# Altium schematic sheet 0128_EC - MISCELLANEOUS.SchDoc
size 848 x 558 mm
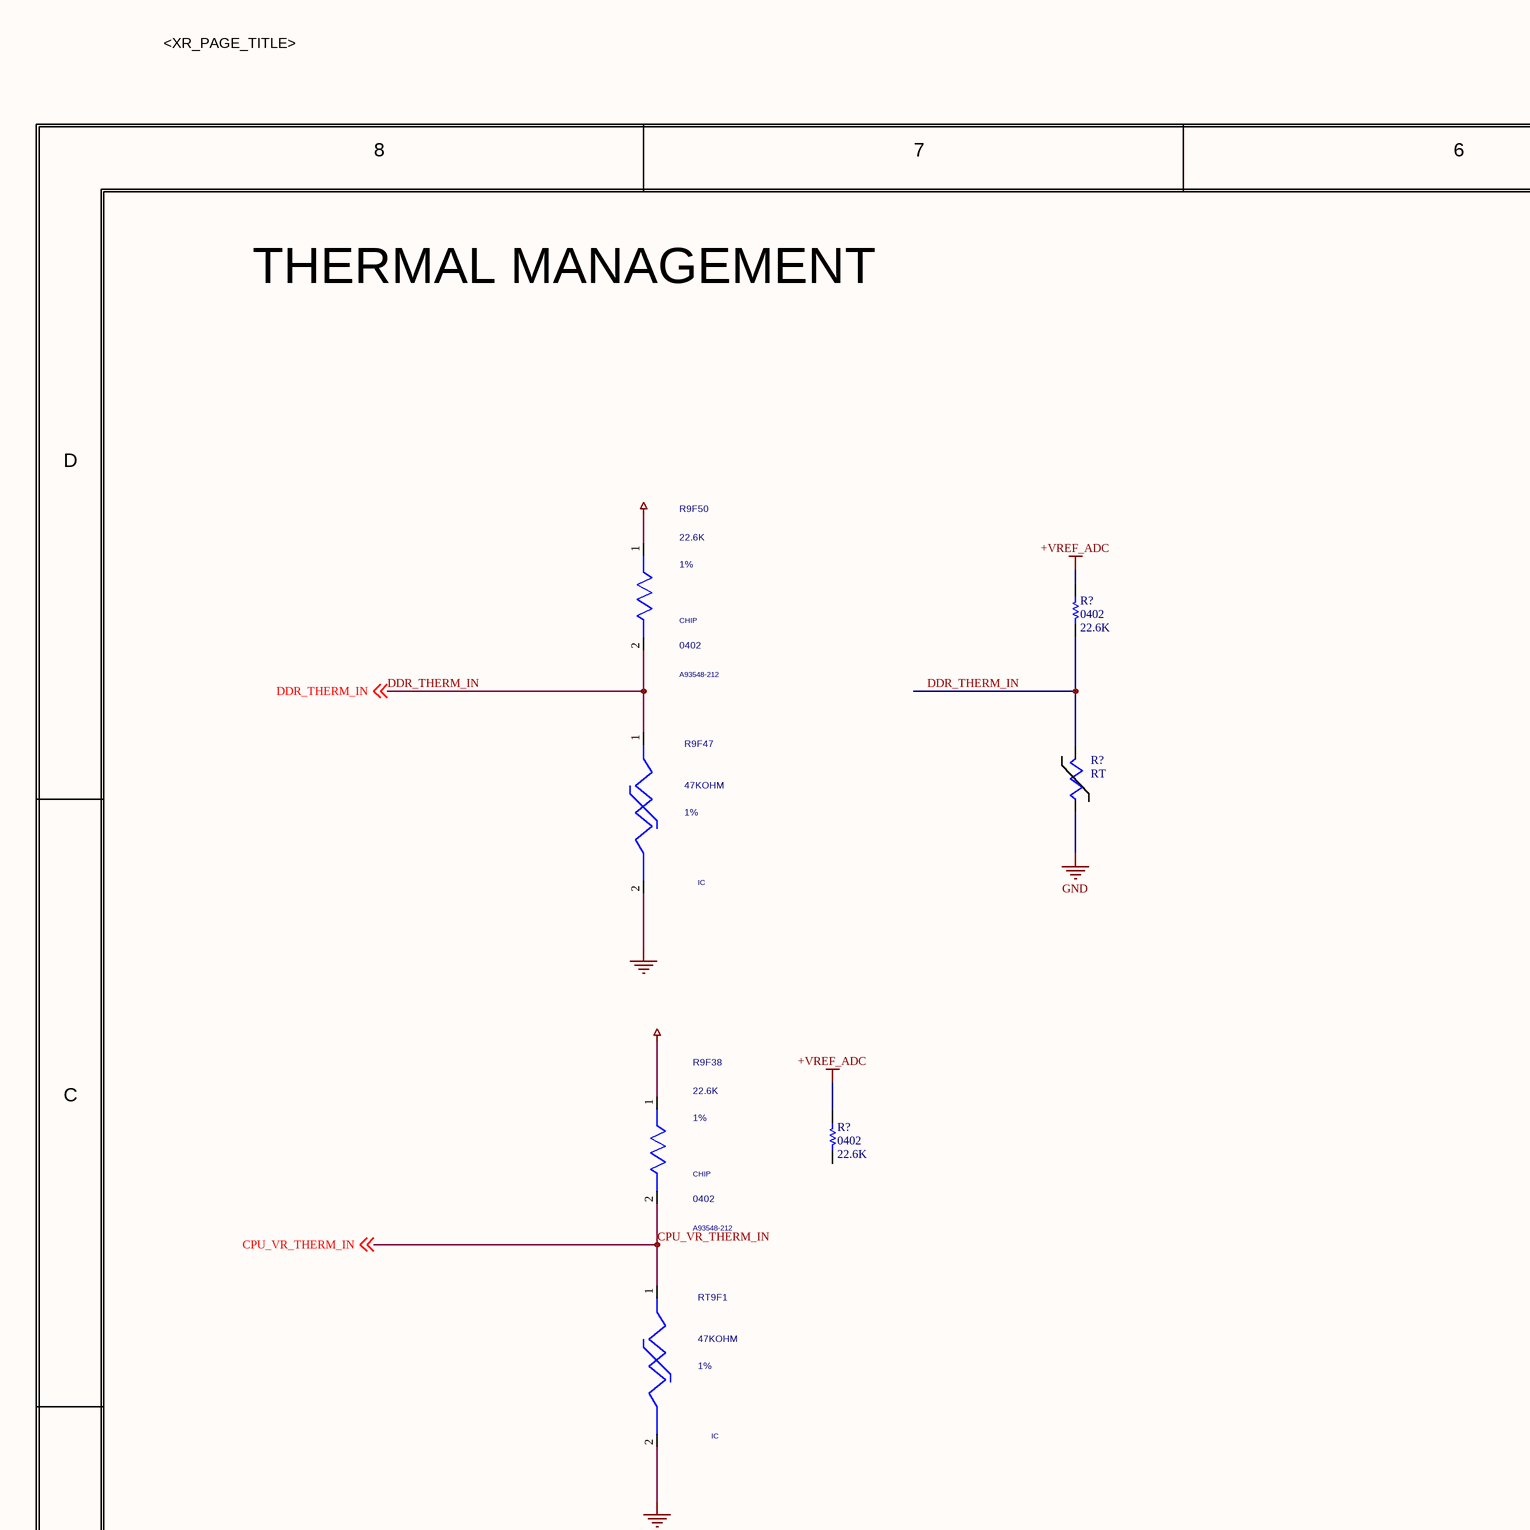
[diagram p0: 0128_EC - MISCELLANEOUS.SchDoc, top left]
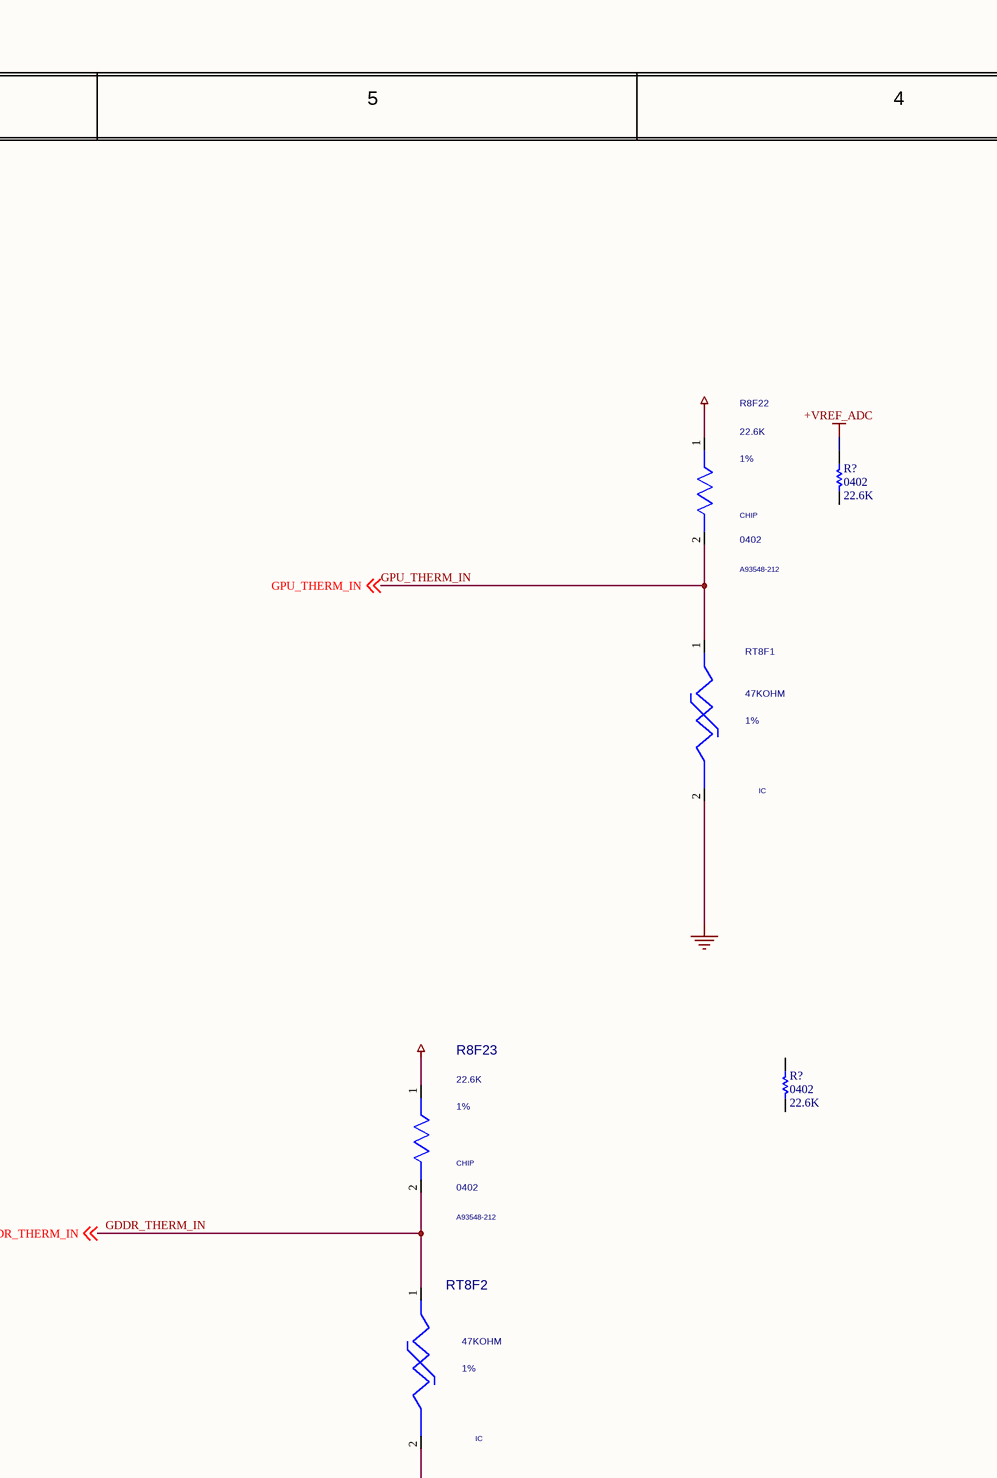
[diagram p1: 0128_EC - MISCELLANEOUS.SchDoc, top middle]
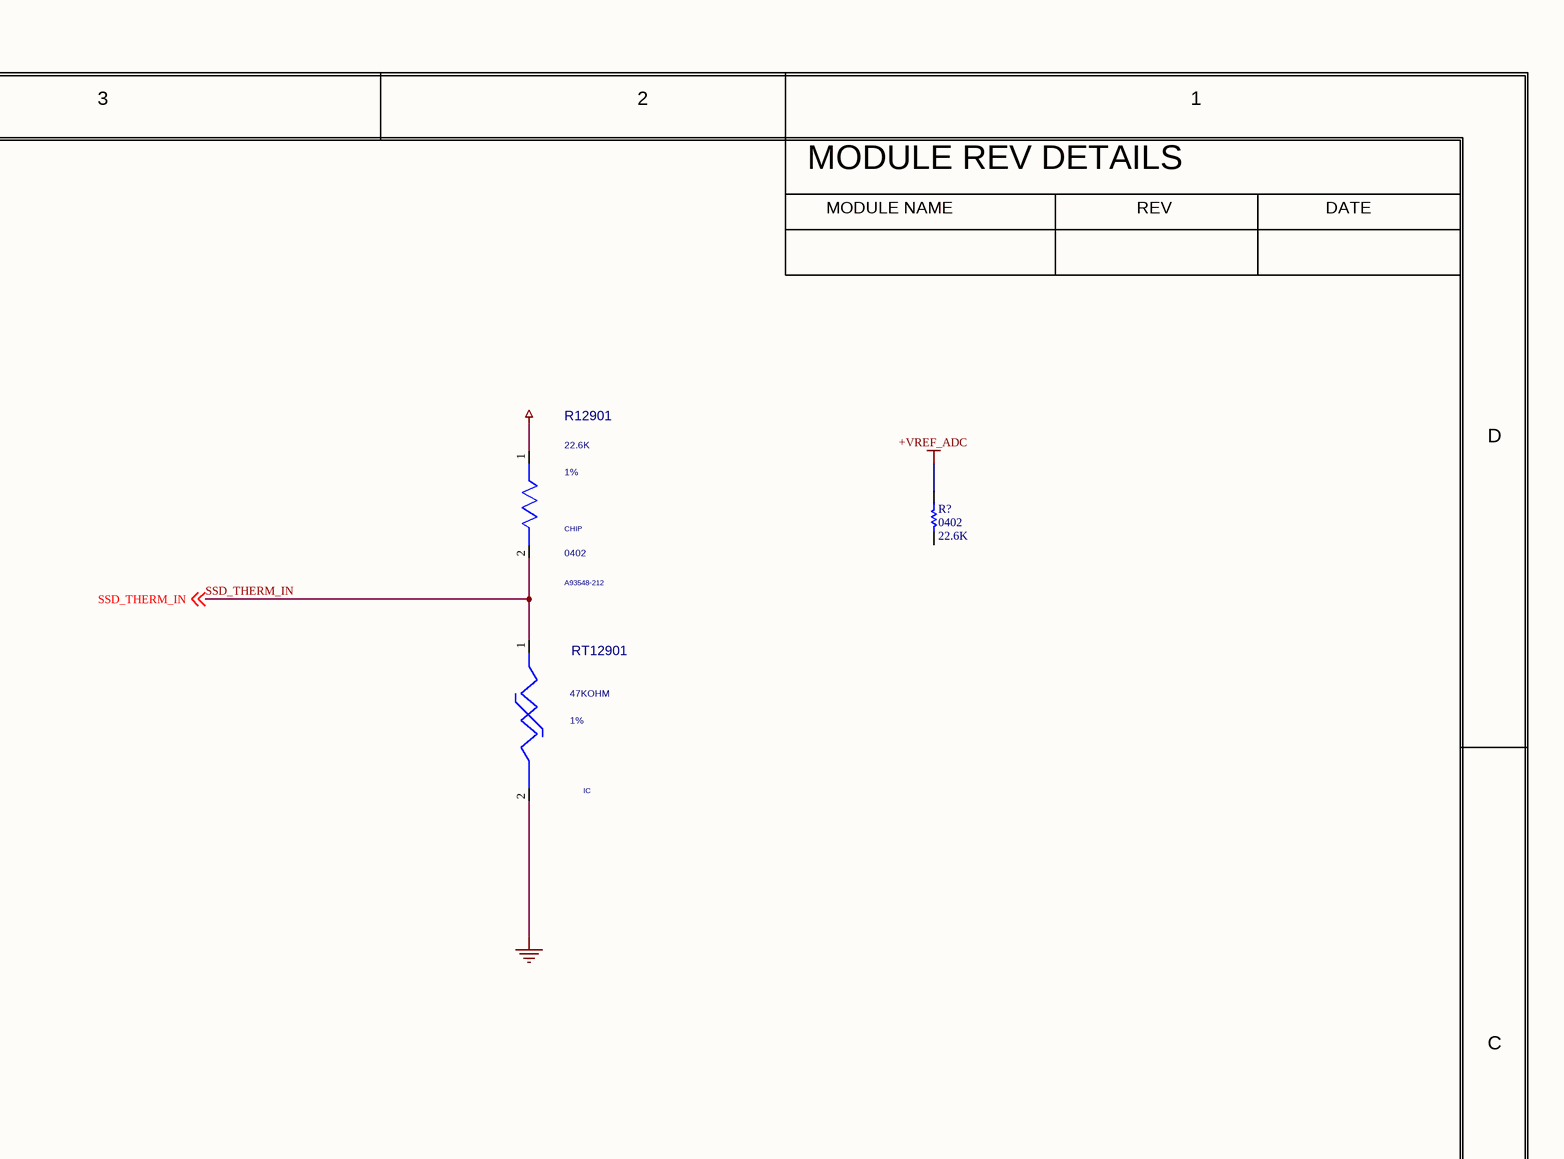
[diagram p2: 0128_EC - MISCELLANEOUS.SchDoc, top right]
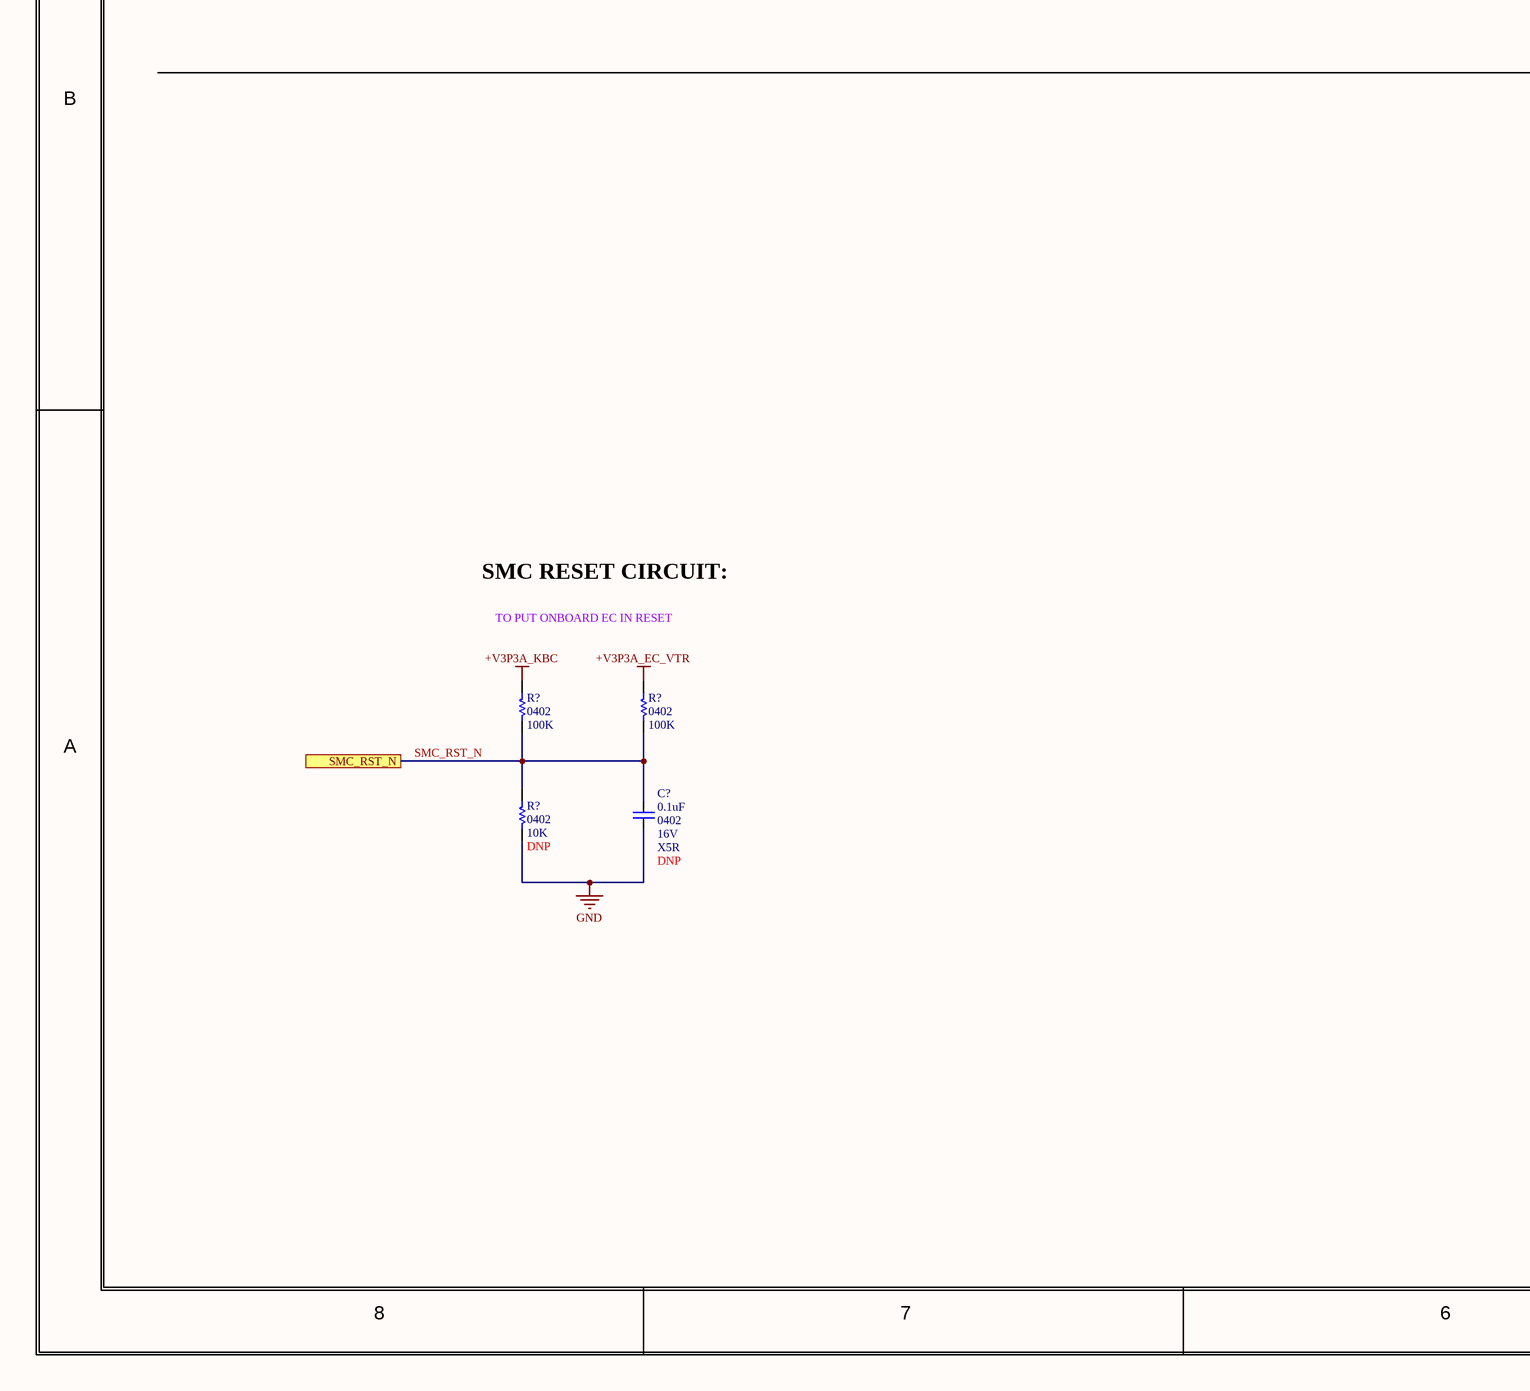
[diagram p3: 0128_EC - MISCELLANEOUS.SchDoc, bottom left]
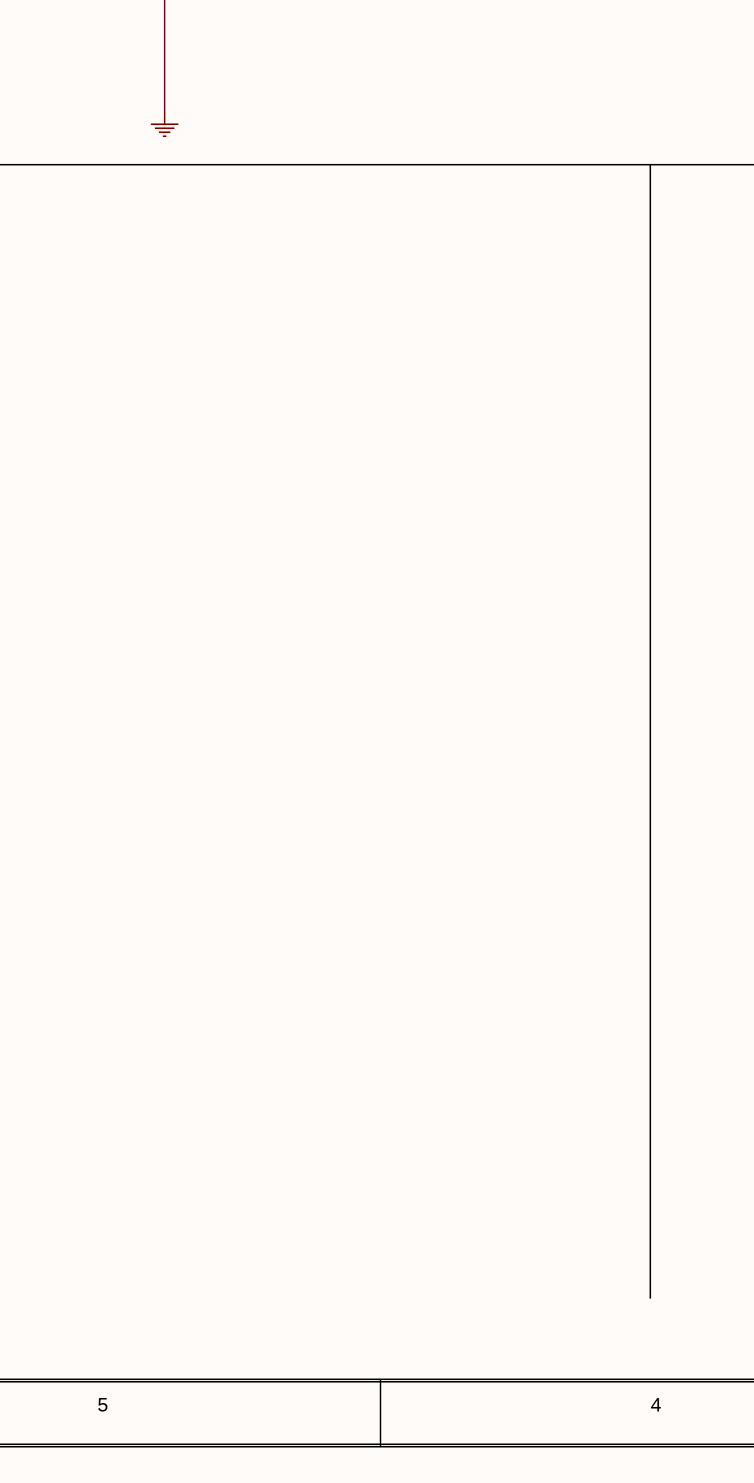
[diagram p4: 0128_EC - MISCELLANEOUS.SchDoc, bottom middle]
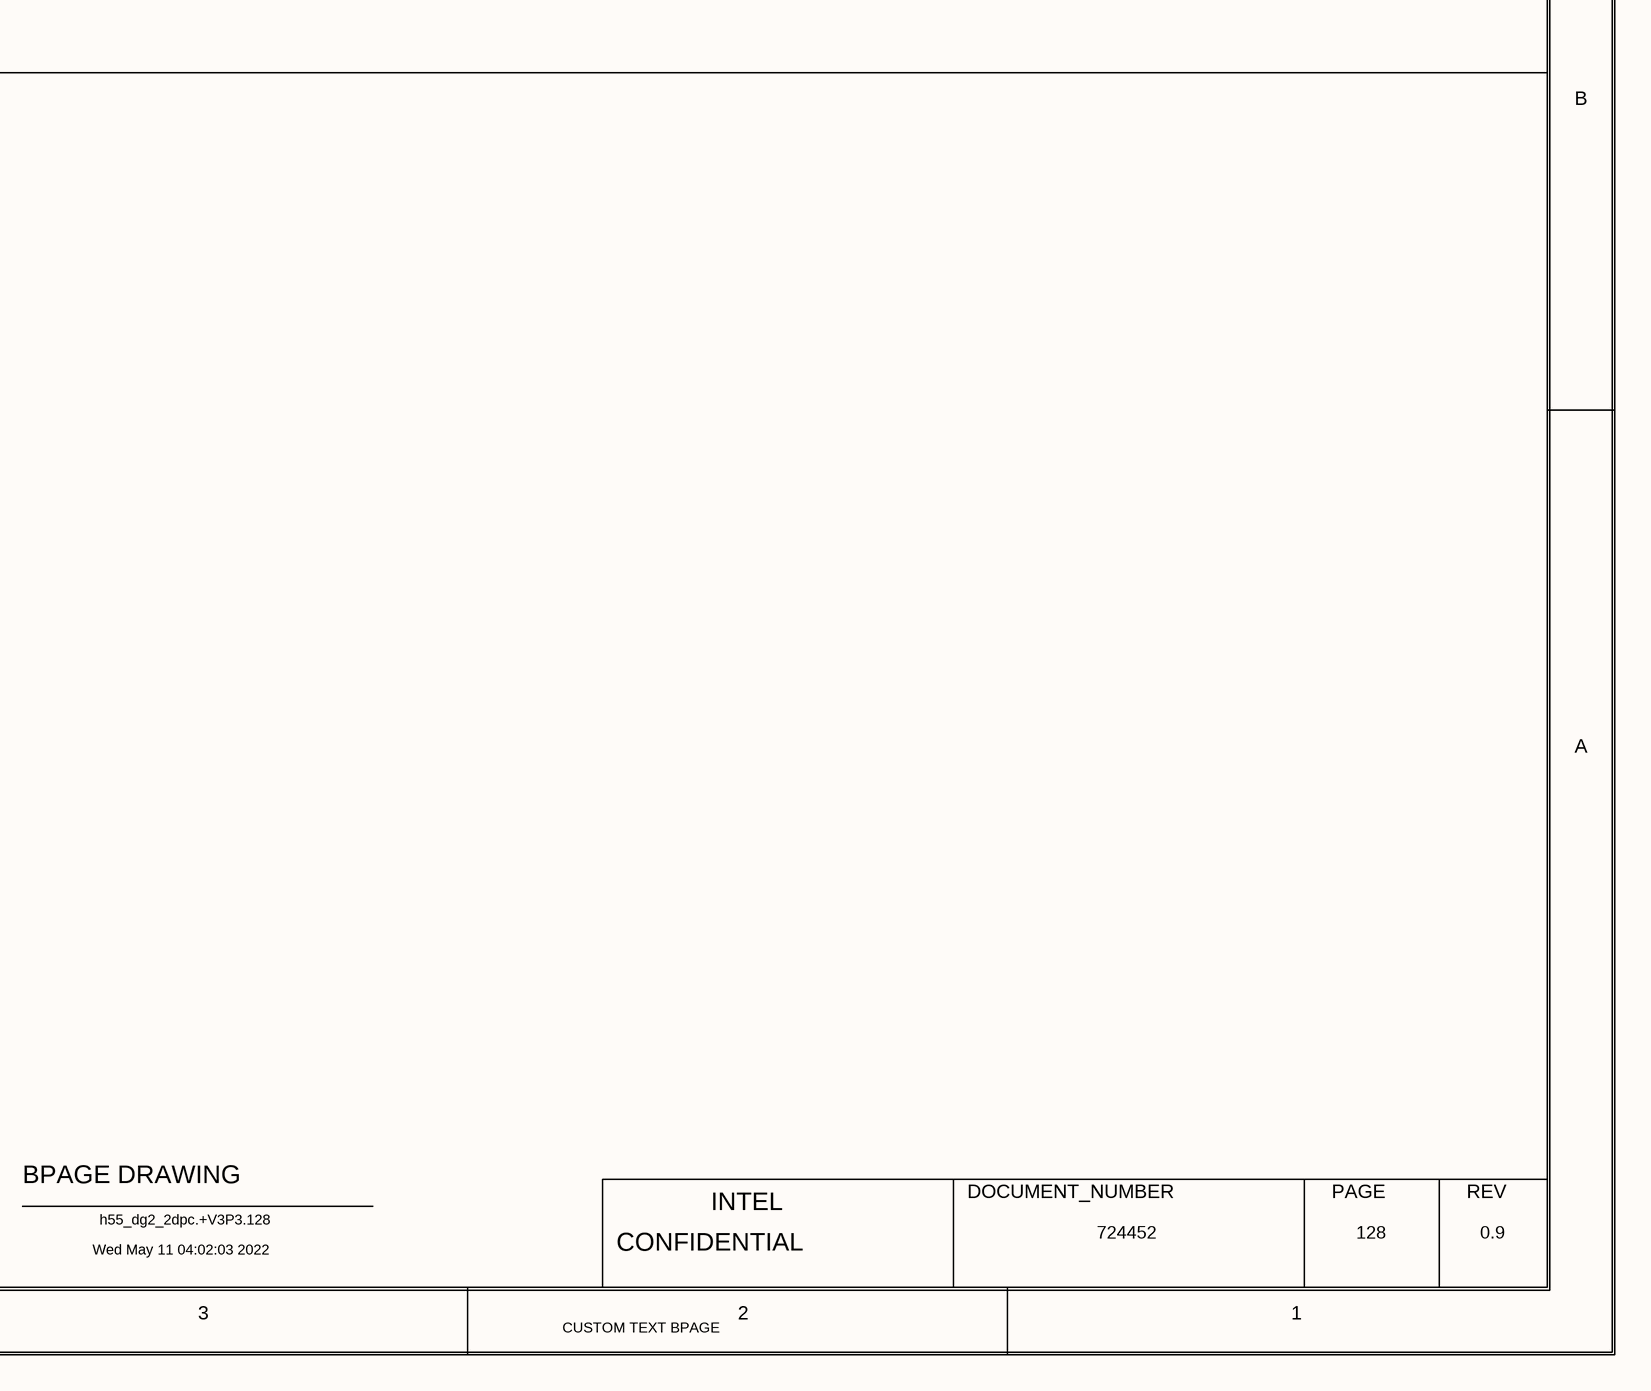
[diagram p5: 0128_EC - MISCELLANEOUS.SchDoc, bottom right]

## Parts
(Parts that share a designator on the sheet are numbered #1, #2 ... from top to bottom, then left to right.)
C?  value 0.1uF  Case/Package: 0402  Voltage: 16V  Dielectric: X5R  [CAPC0402]
R8F22  22.6K  MATERIAL: CHIP  PACK_TYPE: 0402  PART_NUMBER: A93548-212  TOLERANCE: 1%  [SMR0402IA]
R8F23  22.6K  MATERIAL: CHIP  PACK_TYPE: 0402  PART_NUMBER: A93548-212  TOLERANCE: 1%  [SMR0402IA]
R9F38  22.6K  MATERIAL: CHIP  PACK_TYPE: 0402  PART_NUMBER: A93548-212  TOLERANCE: 1%  [SMR0402IA]
R9F47  47KOHM  MATERIAL: IC  TOLERANCE: 1%  [STR0402MA]
R9F50  22.6K  MATERIAL: CHIP  PACK_TYPE: 0402  PART_NUMBER: A93548-212  TOLERANCE: 1%  [SMR0402IA]
R12901  22.6K  MATERIAL: CHIP  PACK_TYPE: 0402  PART_NUMBER: A93548-212  TOLERANCE: 1%  [SMR0402IA]
R?#1  value 22.6K  Case/Package: 0402  [RESC0402]  (hidden comment: Res)
R?#2  value 22.6K  Case/Package: 0402  [RESC0402]  (hidden comment: Res)
R?#3  value 22.6K  Case/Package: 0402  [RESC0402]  (hidden comment: Res)
R?#4  RT
R?#5  value 22.6K  Case/Package: 0402  [RESC0402]  (hidden comment: Res)
R?#6  value 22.6K  Case/Package: 0402  [RESC0402]  (hidden comment: Res)
R?#7  value 100K  Case/Package: 0402  [RESC0402]  (hidden comment: Res)
R?#8  value 100K  Case/Package: 0402  [RESC0402]  (hidden comment: Res)
R?#9  value 10K  Case/Package: 0402  [RESC0603]  (hidden comment: Res)
RT8F1  47KOHM  MATERIAL: IC  TOLERANCE: 1%  [STR0402MA]
RT8F2  47KOHM  MATERIAL: IC  TOLERANCE: 1%  [STR0402MA]
RT9F1  47KOHM  MATERIAL: IC  TOLERANCE: 1%  [STR0402MA]
RT12901  47KOHM  MATERIAL: IC  TOLERANCE: 1%  [STR0402MA]

## Ports
SMC_RST_N

## Nets
+V3P3A_EC_VTR: R?#8.2
+V3P3A_KBC: R?#7.2
+VREF_ADC: R8F22.1(A) R8F23.1(A) R9F38.1(A) R9F50.1(A) R12901.1(A) R?#1.2 R?#2.2 R?#3.2 R?#5.2
GND: C?.1 R9F47.2(B[0]) R?#4.1 R?#9.1 RT8F1.2(B[0]) RT8F2.2(B[0]) RT9F1.2(B[0]) RT12901.2(B[0])
CPU_VR_THERM_IN: R9F38.2(B) RT9F1.1(A[0]) ; off-sheet CPU_VR_THERM_IN
DDR_THERM_IN: R9F47.1(A[0]) R9F50.2(B) R?#3.1 R?#4.2 ; off-sheet DDR_THERM_IN
GDDR_THERM_IN: R8F23.2(B) RT8F2.1(A[0]) ; off-sheet GDDR_THERM_IN
GPU_THERM_IN: R8F22.2(B) RT8F1.1(A[0]) ; off-sheet GPU_THERM_IN
SMC_RST_N: C?.2 R?#7.1 R?#8.1 R?#9.2 ; port SMC_RST_N
SSD_THERM_IN: R12901.2(B) RT12901.1(A[0]) ; off-sheet SSD_THERM_IN

Not connected (* = marked no-connect by the designer): R?#1 1; R?#2 1; R?#5 1; R?#6 1 2

## Notes on the sheet
- <XR_PAGE_TITLE>
- 8
- 7
- 6
- 5
- 4
- 3
- 2
- 1
- MODULE REV DETAILS
- THERMAL MANAGEMENT
- MODULE NAME
- REV
- DATE
- D
- C
- B
- SMC RESET CIRCUIT:
- TO PUT ONBOARD EC IN RESET
- A
- BPAGE DRAWING
- INTEL
- DOCUMENT_NUMBER
- PAGE
- Wed May 11 04:02:03 2022
- h55_dg2_2dpc.+V3P3.128
- CONFIDENTIAL
- 724452
- 128
- 0.9
- CUSTOM TEXT BPAGE

## Library data of the parts
C? = Cap: CAP CER 0.1uF 16V X5R 0402; DNP: DNP
R8F22 = RES: CDS_PHYS_PART_NAME: RES_0402-A93548-212,CHIP,22.6K,1%,1/16W,LPDB,GENERIC; WATTAGE: 1/16W; OriginalSymbolOrigin: (-25,75); XY: (-3875,4350); VER: 2; ROT: 0; PHYS_PAGE: 128; LOCATION: R8F22; IP: GENERIC; FP_TECH: LPDB; DRAWING: @RVP1_ADL_SB_ADP_S_DDR5_SODIMM_2DPC_LIB.H55_DG2_2DPC(SCH_1):PAGE498; CDS_LIB: discrete; PCB Footprint: SMR0402IA; CHIPS_PART_NAME: RES; CDS_PART_NAME: RES_0402-A93548-212,CHIP,22.6K,1%,1/16W,LPDB,GENERIC; CDS_LOCATION: R8F22; ASI_MODEL: A93548-212
R8F23 = RES: CDS_PHYS_PART_NAME: RES_0402-A93548-212,CHIP,22.6K,1%,1/16W,LPDB,GENERIC; WATTAGE: 1/16W; OriginalSymbolOrigin: (-25,75); XY: (-4400,3150); VER: 2; ROT: 0; PHYS_PAGE: 128; LOCATION: R8F23; IP: GENERIC; FP_TECH: LPDB; DRAWING: @RVP1_ADL_SB_ADP_S_DDR5_SODIMM_2DPC_LIB.H55_DG2_2DPC(SCH_1):PAGE498; CDS_LIB: discrete; PCB Footprint: SMR0402IA; CHIPS_PART_NAME: RES; CDS_PART_NAME: RES_0402-A93548-212,CHIP,22.6K,1%,1/16W,LPDB,GENERIC; CDS_LOCATION: R8F23; ASI_MODEL: A93548-212
R9F38 = RES: CDS_PHYS_PART_NAME: RES_0402-A93548-212,CHIP,22.6K,1%,1/16W,LPDB,GENERIC; WATTAGE: 1/16W; OriginalSymbolOrigin: (-25,75); XY: (-6975,3225); VER: 2; ROT: 0; PHYS_PAGE: 128; LOCATION: R9F38; IP: GENERIC; FP_TECH: LPDB; DRAWING: @RVP1_ADL_SB_ADP_S_DDR5_SODIMM_2DPC_LIB.H55_DG2_2DPC(SCH_1):PAGE498; CDS_LIB: discrete; PCB Footprint: SMR0402IA; CHIPS_PART_NAME: RES; CDS_PART_NAME: RES_0402-A93548-212,CHIP,22.6K,1%,1/16W,LPDB,GENERIC; CDS_LOCATION: R9F38; ASI_MODEL: A93548-212
R9F47 = THERM_NTC: PART_NUMBER: C98257-004; CDS_PHYS_PART_NAME: THERM_NTC_0402-C98257-004,IC,47KOHM,1%,NULL,LPDB,GENERIC; CDS_LMAN_SYM_OUTLINE: -50,100,50,-100; PACK_TYPE: 0402; OriginalSymbolOrigin: (-25,125); XY: (-7000,3850); WATTAGE: NULL; VER: 2; ROT: 0; PHYS_PAGE: 128; LOCATION: R9F47; IP: GENERIC; FP_TECH: LPDB; DRAWING: @RVP1_ADL_SB_ADP_S_DDR5_SODIMM_2DPC_LIB.H55_DG2_2DPC(SCH_1):PAGE498; CDS_LIB: discrete; SIZE: 1B; PCB Footprint: STR0402MA; CHIPS_PART_NAME: THERM_NTC; CDS_PART_NAME: THERM_NTC_0402-C98257-004,IC,47KOHM,1%,NULL,LPDB,GENERIC; CDS_LOCATION: R9F47; ASI_MODEL: C98257-004
R9F50 = RES: CDS_PHYS_PART_NAME: RES_0402-A93548-212,CHIP,22.6K,1%,1/16W,LPDB,GENERIC; WATTAGE: 1/16W; OriginalSymbolOrigin: (-25,75); XY: (-7000,4250); VER: 2; ROT: 0; PHYS_PAGE: 128; LOCATION: R9F50; IP: GENERIC; FP_TECH: LPDB; DRAWING: @RVP1_ADL_SB_ADP_S_DDR5_SODIMM_2DPC_LIB.H55_DG2_2DPC(SCH_1):PAGE498; CDS_LIB: discrete; PCB Footprint: SMR0402IA; CHIPS_PART_NAME: RES; CDS_PART_NAME: RES_0402-A93548-212,CHIP,22.6K,1%,1/16W,LPDB,GENERIC; CDS_LOCATION: R9F50; ASI_MODEL: A93548-212
R12901 = RES: CDS_PHYS_PART_NAME: RES_0402-A93548-212,CHIP,22.6K,1%,1/16W,LPDB,GENERIC; WATTAGE: 1/16W; OriginalSymbolOrigin: (-25,75); XY: (-1725,4325); VER: 2; ROT: 0; PHYS_PAGE: 128; LOCATION: R12901; IP: GENERIC; FP_TECH: LPDB; DRAWING: @RVP1_ADL_SB_ADP_S_DDR5_SODIMM_2DPC_LIB.H55_DG2_2DPC(SCH_1):PAGE498; CDS_LIB: discrete; PCB Footprint: SMR0402IA; CHIPS_PART_NAME: RES; CDS_PART_NAME: RES_0402-A93548-212,CHIP,22.6K,1%,1/16W,LPDB,GENERIC; CDS_LOCATION: R12901; ASI_MODEL: A93548-212
R?#1-R?#3 R?#5 R?#6 = Res: Thick Film Resistor -  22.6Kohm, 1%,0402
R?#4 = RT: Value: 47K; Case/Package: *; Manufacturer Part Number: *
R?#7 R?#8 = Res: Thick Film Resistor -  100Kohm, 1%,0402
R?#9 = Res: Thick Film Resistor -  10Kohm, 1%,0402; DNP: DNP
RT8F1 = THERM_NTC: PART_NUMBER: C98257-004; CDS_PHYS_PART_NAME: THERM_NTC_0402-C98257-004,IC,47KOHM,1%,NULL,LPDB,GENERIC; CDS_LMAN_SYM_OUTLINE: -50,100,50,-100; PACK_TYPE: 0402; OriginalSymbolOrigin: (-25,125); XY: (-3875,3925); WATTAGE: NULL; VER: 2; ROT: 0; PHYS_PAGE: 128; LOCATION: RT8F1; IP: GENERIC; FP_TECH: LPDB; DRAWING: @RVP1_ADL_SB_ADP_S_DDR5_SODIMM_2DPC_LIB.H55_DG2_2DPC(SCH_1):PAGE498; CDS_LIB: discrete; SIZE: 1B; PCB Footprint: STR0402MA; CHIPS_PART_NAME: THERM_NTC; CDS_PART_NAME: THERM_NTC_0402-C98257-004,IC,47KOHM,1%,NULL,LPDB,GENERIC; CDS_LOCATION: RT8F1; ASI_MODEL: C98257-004
RT8F2 = THERM_NTC: PART_NUMBER: C98257-004; CDS_PHYS_PART_NAME: THERM_NTC_0402-C98257-004,IC,47KOHM,1%,NULL,LPDB,GENERIC; CDS_LMAN_SYM_OUTLINE: -50,100,50,-100; PACK_TYPE: 0402; OriginalSymbolOrigin: (-25,125); XY: (-4400,2725); WATTAGE: NULL; VER: 2; ROT: 0; PHYS_PAGE: 128; LOCATION: RT8F2; IP: GENERIC; FP_TECH: LPDB; DRAWING: @RVP1_ADL_SB_ADP_S_DDR5_SODIMM_2DPC_LIB.H55_DG2_2DPC(SCH_1):PAGE498; CDS_LIB: discrete; SIZE: 1B; PCB Footprint: STR0402MA; CHIPS_PART_NAME: THERM_NTC; CDS_PART_NAME: THERM_NTC_0402-C98257-004,IC,47KOHM,1%,NULL,LPDB,GENERIC; CDS_LOCATION: RT8F2; ASI_MODEL: C98257-004
RT9F1 = THERM_NTC: PART_NUMBER: C98257-004; CDS_PHYS_PART_NAME: THERM_NTC_0402-C98257-004,IC,47KOHM,1%,NULL,LPDB,GENERIC; CDS_LMAN_SYM_OUTLINE: -50,100,50,-100; PACK_TYPE: 0402; OriginalSymbolOrigin: (-25,125); XY: (-6975,2825); WATTAGE: NULL; VER: 2; ROT: 0; PHYS_PAGE: 128; LOCATION: RT9F1; IP: GENERIC; FP_TECH: LPDB; DRAWING: @RVP1_ADL_SB_ADP_S_DDR5_SODIMM_2DPC_LIB.H55_DG2_2DPC(SCH_1):PAGE498; CDS_LIB: discrete; SIZE: 1B; PCB Footprint: STR0402MA; CHIPS_PART_NAME: THERM_NTC; CDS_PART_NAME: THERM_NTC_0402-C98257-004,IC,47KOHM,1%,NULL,LPDB,GENERIC; CDS_LOCATION: RT9F1; ASI_MODEL: C98257-004
RT12901 = THERM_NTC: PART_NUMBER: C98257-004; CDS_PHYS_PART_NAME: THERM_NTC_0402-C98257-004,IC,47KOHM,1%,NULL,LPDB,GENERIC; CDS_LMAN_SYM_OUTLINE: -50,100,50,-100; PACK_TYPE: 0402; OriginalSymbolOrigin: (-25,125); XY: (-1725,3925); WATTAGE: NULL; VER: 2; ROT: 0; PHYS_PAGE: 128; LOCATION: RT12901; IP: GENERIC; FP_TECH: LPDB; DRAWING: @RVP1_ADL_SB_ADP_S_DDR5_SODIMM_2DPC_LIB.H55_DG2_2DPC(SCH_1):PAGE498; CDS_LIB: discrete; SIZE: 1B; PCB Footprint: STR0402MA; CHIPS_PART_NAME: THERM_NTC; CDS_PART_NAME: THERM_NTC_0402-C98257-004,IC,47KOHM,1%,NULL,LPDB,GENERIC; CDS_LOCATION: RT12901; ASI_MODEL: C98257-004